# Altium project AC Carrier.PrjPcb
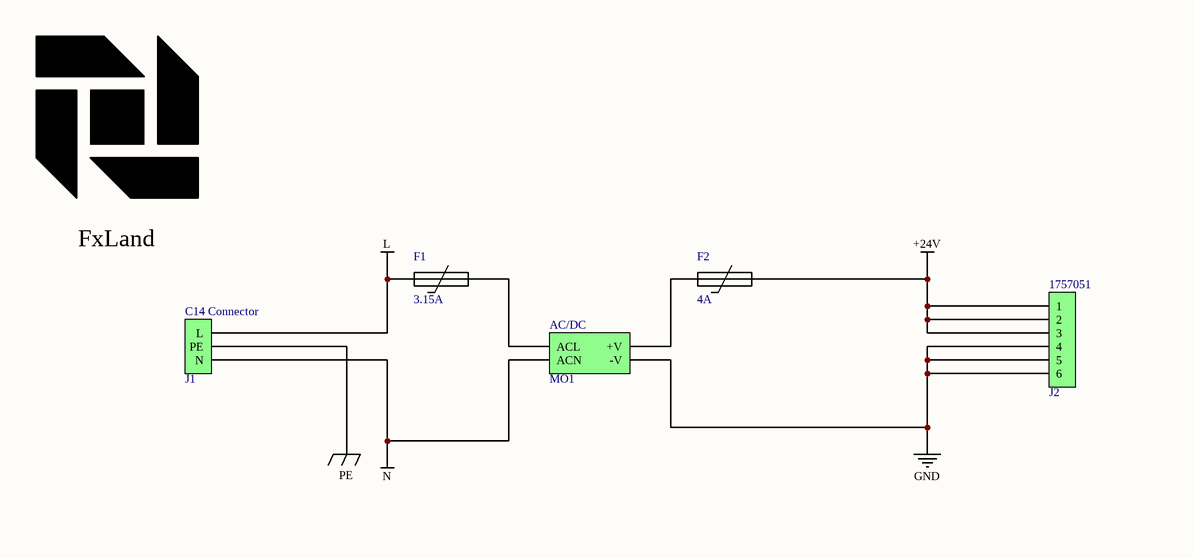
[diagram p0: 001_top.SchDoc, left]
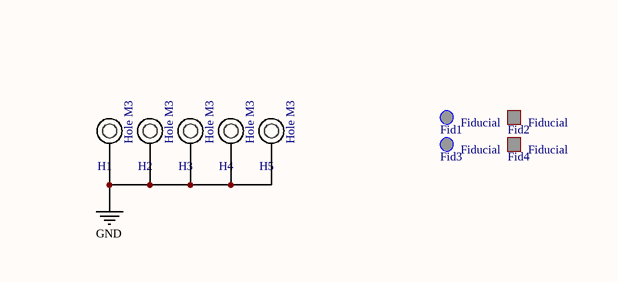
[diagram p1: 001_top.SchDoc, right]
DocNumber: P234; PrName: Blox AC-DC; Rev: 1.1
1 sheet, 15 parts. Net scope: global (net labels, ports and power ports of the same name join across sheets).
Board file: AC Carrier.PcbDoc

## Sheet 001_top.SchDoc
size A2; Organization: Greenfield Tech Solutions; Address1: Molendreef 33; Address2: Ossendrecht; Address3: 4641CS; Address4: The Netherlands; DocumentNumber: P234; Revision: 1.1; SheetNumber: 1; SheetTotal: 1

### Parts
F1  3.15A  [Lead2INCHSqaure]
F2  4A  [F1206]
Fid1  Fiducial  [FidR_1.0mm]
Fid2  Fiducial  [FidS_1.0mm]
Fid3  Fiducial  [FidR_1.0mm]
Fid4  Fiducial  [FidS_1.0mm]
H1  Hole M3  [HOLE_M3]
H2  Hole M3  [HOLE_M3]
H3  Hole M3  [HOLE_M3]
H4  Hole M3  [HOLE_M3]
H5  Hole M3  [HOLE_M3]
J1  C14 Connector  [IEC_INLET_PX0575SERIES]
J2  1757051  [1757051]
Logo_FxLand  FxLand  [Logo_FxLand_3]  (value not drawn)
MO1  AC/DC  [ECE80]

### Nets
+24V: F2.2 J2.1 J2.2 J2.3
GND: H1.1 H2.1 H3.1 H4.1 H5.1 J2.4 J2.5 J2.6 MO1.-V
L: F1.1 J1.1(L)
N: J1.3(N) MO1.ACN
PE: J1.2(PE)
NetF1_2: F1.2 MO1.ACL
NetF2_1: F2.1 MO1.+V

### Notes on the sheet
- Title
- Size:
- Date:
- File:
- A2
- Number:
- Time:
- Revision:
- Sheet
- of

### Library data of the parts
F1 = F0003: AC 3.15A; Part Number: F0003; ManfactPart: 0697A3150-01; ID: 3; RefVal: 3.15A
F2 = F0013: 65V/4A; Part Number: F0013; ManfactPart: SF-1206SA400M-2; ID: 13; RefVal: 4A
Fid1 Fid3 = ME0011: Fiducial Round 1mm; Part Number: ME0011; ID: 11; RefVal: Fiducial
Fid2 Fid4 = ME0012: Fiducial Sqaure 1mm; Part Number: ME0012; ID: 12; RefVal: Fiducial
H1-H5 = ME0001: Mounting Hole M3; Part Number: ME0001; ID: 1; RefVal: Hole M3
J1 = CO0038: Part Number: CO0038; ManfactPart: PX0575/10/PC; ID: 38; RefVal: C14 Connector
J2 = CO0034: Pluggable Terminal Blocks 6 Pos 5.08mm pitch Plug 24-12 AWG Screw; Part Number: CO0034; ID: 34; RefVal: 1757051; ManfactPart: 1757051
Logo_FxLand = ME0008: Logo FxLand 3; Part Number: ME0008; ID: 8; RefVal: FxLand
MO1 = MO0021: AC-DC Power Supplies; Part Number: MO0021; ManfactPart: ECE80US24; ID: 21; RefVal: AC/DC